# Altium project BLDC-Driver.PrjPcb
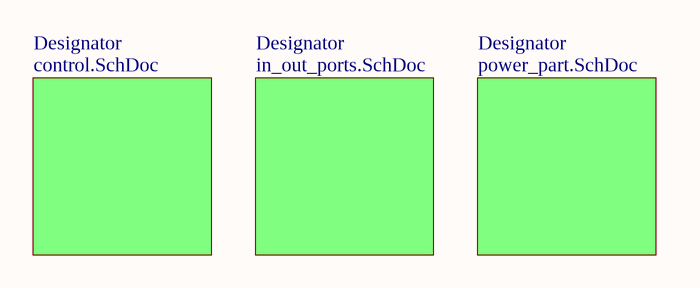
[diagram p0: main.SchDoc]
4 sheets, 59 parts. Net scope: global (net labels, ports and power ports of the same name join across sheets).
Board file: BLDC-Driver.PcbDoc
Sheets:
  main.SchDoc
    Designator = control.SchDoc
    Designator = in_out_ports.SchDoc
    Designator = power_part.SchDoc

## Sheet main.SchDoc
size A; SheetNumber: 1; SheetTotal: 4

### Sub-sheets
Designator = control.SchDoc: no entries
Designator = in_out_ports.SchDoc: no entries
Designator = power_part.SchDoc: no entries

## Sheet control.SchDoc
size A; SheetNumber: 4; SheetTotal: 4
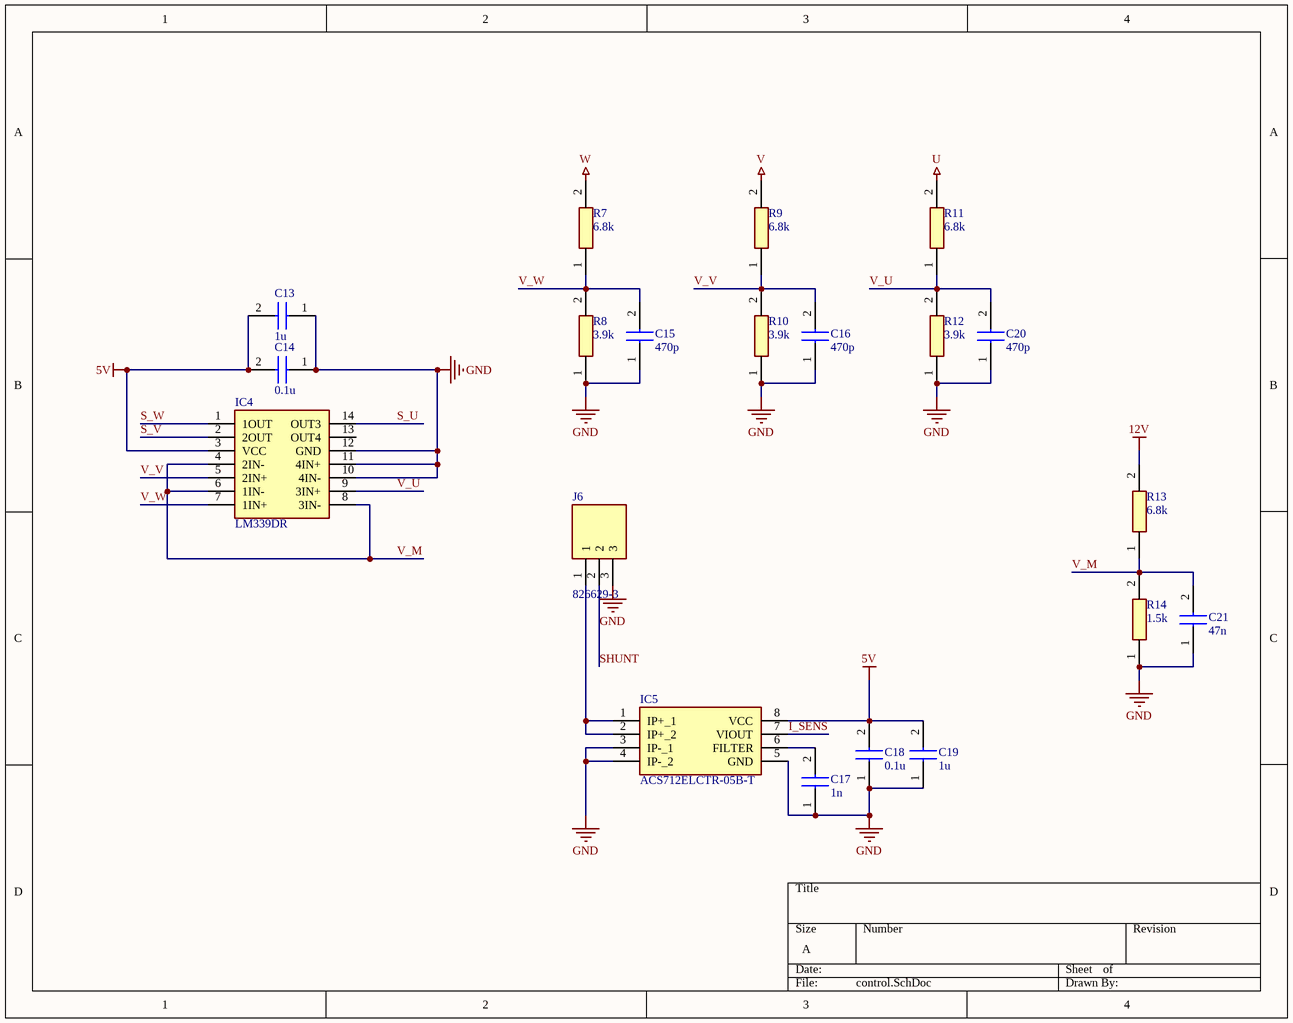
[diagram p1: control.SchDoc]

### Parts
C13  1u  [CAPC2012X145N]
C14  0.1u  [CAPC2012X95N]
C15  470p  [CAPC2012X70N]
C16  470p  [CAPC2012X70N]
C17  1n  [CAPC2012X95N]
C18  0.1u  [CAPC2012X95N]
C19  1u  [CAPC2012X145N]
C20  470p  [CAPC2012X70N]
C21  47n  [CAPC2012X70N]
IC4  LM339DR  [SOIC127P600X175-14N]
IC5  ACS712ELCTR-05B-T  [SOIC127P600X175-8N]
J6  826629-3  [HDRV3W63P0X254_1X3_762X250X950P]
R7  6.8k  [RESC2012X60N]
R8  3.9k  [RESC2012X60N]
R9  6.8k  [RESC2012X60N]
R10  3.9k  [RESC2012X60N]
R11  6.8k  [RESC2012X60N]
R12  3.9k  [RESC2012X60N]
R13  6.8k  [RESC2012X60N]
R14  1.5k  [RESC2012X60N]

### Nets
5V: C13.2 C14.2 C18.2 C19.2 IC4.3(VCC) IC5.8(VCC)
12V: R13.2
GND: C13.1 C14.1 C15.1 C16.1 C17.1 C18.1 C19.1 C20.1 C21.1 IC4.10(4IN-) IC4.11(4IN+) IC4.12(GND) IC5.3(IP-_1) IC5.4(IP-_2) IC5.5(GND) J6.3 R8.1 R10.1 R12.1 R14.1
U: R11.2
V: R9.2
W: R7.2
I_SENS: IC5.7(VIOUT)
S_U: IC4.14(OUT3)
S_V: IC4.2(2OUT)
S_W: IC4.1(1OUT)
SHUNT: J6.2
V_M: C21.2 IC4.4(2IN-) IC4.6(1IN-) IC4.8(3IN-) R13.1 R14.2
V_U: C20.2 IC4.9(3IN+) R11.1 R12.2
V_V: C16.2 IC4.5(2IN+) R9.1 R10.2
V_W: C15.2 IC4.7(1IN+) R7.1 R8.2
NetC17_2: C17.2 IC5.6(FILTER)
NetIC5_1: IC5.1(IP+_1) IC5.2(IP+_2) J6.1

Not connected (* = marked no-connect by the designer): IC4 13(OUT4)

### Library data of the parts
C13 C19 = GRM21BR71C105KA01K: Capacitor; Manufacturer_Name: Murata Electronics; Datasheet Link: http://www.murata.com/~/media/webrenewal/support/library/catalog/products/capacitor/mlcc/c02e.pdf; Height: 1.45mm; Manufacturer_Part_Number: GRM21BR71C105KA01K; Mouser Part Number: 81-GRM40X105K16K; Mouser Price/Stock: https://www.mouser.co.uk/ProductDetail/Murata-Electronics/GRM21BR71C105KA01K?qs=WNiIrCCjU2S8h%252B9o4PZIpA%3D%3D; Arrow Part Number: GRM21BR71C105KA01K; Arrow Price/Stock: https://www.arrow.com/en/products/grm21br71c105ka01k/murata-manufacturing?region=nac
C14 C17 C18 = GRM219F51H104ZA01B: Capacitor; Manufacturer_Name: Murata Electronics; Datasheet Link: http://www.murata.com/~/media/webrenewal/support/library/catalog/products/capacitor/mlcc/c02e.pdf; Height: 0.95mm; Manufacturer_Part_Number: GRM219F51H104ZA01B; Mouser Part Number: 81-GRM21F51H104ZA01B; Mouser Price/Stock: https://www.mouser.co.uk/ProductDetail/Murata-Electronics/GRM219F51H104ZA01B?qs=A13M%252BoT%252Bkzo6MjTOB8REcg%3D%3D
C15 C16 C20 C21 = GRM2165C1H471JA01D: Capacitor; Manufacturer_Name: Murata Electronics; Datasheet Link: http://www.murata.com/~/media/webrenewal/support/library/catalog/products/capacitor/mlcc/c02e.pdf; Height: 0.7mm; Manufacturer_Part_Number: GRM2165C1H471JA01D; Mouser Part Number: 81-GRM215C1H471JA01D; Mouser Price/Stock: https://www.mouser.co.uk/ProductDetail/Murata-Electronics/GRM2165C1H471JA01D?qs=kEQ31%252BHm99mGVasPXslxeg%3D%3D; Arrow Part Number: GRM2165C1H471JA01D; Arrow Price/Stock: https://www.arrow.com/en/products/grm2165c1h471ja01d/murata-manufacturing?region=nac
IC4 = LM339DR: Integrated Circuit; Manufacturer_Name: Texas Instruments; Datasheet Link: http://www.ti.com/lit/gpn/lm339; Height: 1.75mm; Manufacturer_Part_Number: LM339DR; Mouser Part Number: 595-LM339DR; Mouser Price/Stock: https://www.mouser.co.uk/ProductDetail/Texas-Instruments/LM339DR?qs=vxEfx8VrU7Aps9Hd52ppTA%3D%3D; Arrow Part Number: LM339DR; Arrow Price/Stock: https://www.arrow.com/en/products/lm339dr/texas-instruments?region=nac
IC5 = ACS712ELCTR-05B-T: Integrated Circuit; Manufacturer_Name: Allegro Microsystems; Datasheet Link: https://www.allegromicro.com/~/media/Files/Datasheets/ACS712-Datasheet.ashx; Height: 1.75mm; Manufacturer_Part_Number: ACS712ELCTR-05B-T; Mouser Part Number: 250-712ELCTR05BT; Mouser Price/Stock: https://www.mouser.co.uk/ProductDetail/Allegro-MicroSystems/ACS712ELCTR-05B-T?qs=pUKx8fyJudDs65Rkshv5ug%3D%3D; Arrow Part Number: ACS712ELCTR-05B-T; Arrow Price/Stock: https://www.arrow.com/en/products/acs712elctr-05b-t/allegro-microsystems?region=europe
J6 = 826629-3: Connector; Manufacturer_Name: TE Connectivity; Datasheet Link: http://www.te.com/commerce/DocumentDelivery/DDEController?Action=showdoc&DocId=Customer+Drawing%7F826629%7FAA%7Fpdf%7FEnglish%7FENG_CD_826629_AA_baseFilename.pdf%7F826629-3.pdf; Height: 9.5mm; Manufacturer_Part_Number: 826629-3; Mouser Part Number: 571-826629-3; Mouser Price/Stock: https://www.mouser.co.uk/ProductDetail/TE-Connectivity/826629-3?qs=AplfTeSvkkA3hKOe%252BWTzDA%3D%3D; Arrow Part Number: 826629-3; Arrow Price/Stock: https://www.arrow.com/en/products/826629-3/te-connectivity?region=europe
R7 R9 R11 R13 = RC0805FR-076K8L: Resistor; Manufacturer_Name: KEMET; Datasheet Link: http://www.yageo.com/documents/recent/PYu-RC_Group_51_RoHS_L_10.pdf; Height: 0.6mm; Manufacturer_Part_Number: RC0805FR-076K8L; Mouser Part Number: 603-RC0805FR-076K8L; Mouser Price/Stock: https://www.mouser.com/Search/Refine.aspx?Keyword=603-RC0805FR-076K8L; Arrow Part Number: RC0805FR-076K8L; Arrow Price/Stock: https://www.arrow.com/en/products/rc0805fr-076k8l/yageo
R8 R10 R12 = RC0805FR-073K9L: Resistor; Manufacturer_Name: KEMET; Datasheet Link: http://www.yageo.com/documents/recent/PYu-RC_Group_51_RoHS_L_10.pdf; Height: 0.6mm; Manufacturer_Part_Number: RC0805FR-073K9L; Mouser Part Number: 603-RC0805FR-073K9L; Mouser Price/Stock: https://www.mouser.com/Search/Refine.aspx?Keyword=603-RC0805FR-073K9L
R14 = RC0805FR-071K5L: Resistor; Manufacturer_Name: YAGEO; Datasheet Link: https://br.mouser.com/datasheet/2/447/YAGEO_PYu_RC_Group_51_RoHS_L_12-3313492.pdf; Height: 0.6mm; Manufacturer_Part_Number: RC0805FR-071K5L; Mouser Part Number: 603-RC0805FR-071K5L; Mouser Price/Stock: https://www.mouser.co.uk/ProductDetail/YAGEO/RC0805FR-071K5L?qs=8Y8p%252BasKcI6LbaohOVk4HA%3D%3D; Arrow Part Number: RC0805FR-071K5L; Arrow Price/Stock: https://www.arrow.com/en/products/rc0805fr-071k5l/yageo?region=nac

## Sheet in_out_ports.SchDoc
size A; SheetNumber: 2; SheetTotal: 4
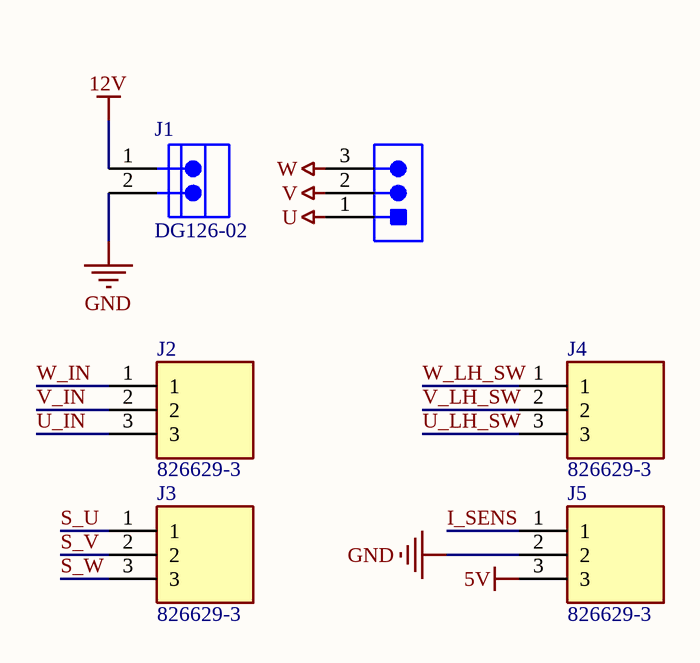
[diagram p2: in_out_ports.SchDoc]

### Parts
J1  DG126-02  [CXKF-KF129C-2_V]
J2  826629-3  [HDRV3W63P0X254_1X3_762X250X950P]
J3  826629-3  [HDRV3W63P0X254_1X3_762X250X950P]
J4  826629-3  [HDRV3W63P0X254_1X3_762X250X950P]
J5  826629-3  [HDRV3W63P0X254_1X3_762X250X950P]
MOTOR  SCREW-5.0/5.08 3WAYS  [SCREW-5.0-3WAYS_V]  (value not drawn)

### Nets
5V: J5.3
12V: J1.1
GND: J1.2 J5.2
U: MOTOR.1
V: MOTOR.2
W: MOTOR.3
I_SENS: J5.1
S_U: J3.1
S_V: J3.2
S_W: J3.3
U_IN: J2.3
U_LH_SW: J4.3
V_IN: J2.2
V_LH_SW: J4.2
W_IN: J2.1
W_LH_SW: J4.1

### Library data of the parts
J1 = CMP-0813-00004-1: Euro Terminal Block, 20 A, 300 V, -40 to 105 degC, Pitch 5 mm, 1 x 2 Position, Height 19.2 mm, Tail Length 3.5 mm; PartNumber: KF129C-02P-14; Manufacturer: Cixi KaiFeng; Insulation Resistance: 5000 MOhm / 1000 V; Pitch: Single Pitch; No. of Pole: 2; Rated Voltage: 300 V; Contact: Brass; Rated Current: 20 A; Contact Resistance: 20 mOhm; Withstanding Voltage: AC 1500 V / 1 Min; ComponentLink2Description: Datasheet; PackageReference: KF129C-2; ComponentLink1URL: http://www.nb-kaifeng.com/; ComponentLink2URL: http://www.nb-kaifeng.com/upload/editor/ext_pdf/201208170644598657.pdf; Color: Green; PackageDescription: Terminal Block, Pitch 5 mm, 1 x 2 Position, Height 19.2 mm, Tail Length 3.5 mm; Temp. Range: -40 to 105 degC; Mounting Technology: Through Hole; ComponentLink1Description: Manufacturer URL
J2-J5 = 826629-3: as J6 on sheet control; Datasheet Link: http://www.te.com/commerce/DocumentDelivery/DDEController?Action=showdoc&DocId=Customer+Drawing%7F826629%7FAA%7Fpdf%7FEnglish%7FENG_CD_826629_AA_baseFilename.pdf%7F826629-3.pdf; Height: 9.5mm; Manufacturer_Part_Number: 826629-3; Mouser Part Number: 571-826629-3; Mouser Price/Stock: https://www.mouser.co.uk/ProductDetail/TE-Connectivity/826629-3?qs=AplfTeSvkkA3hKOe%252BWTzDA%3D%3D; Arrow Part Number: 826629-3; Arrow Price/Stock: https://www.arrow.com/en/products/826629-3/te-connectivity?region=europe
MOTOR = CMP-0617-00010-1: Socket, Screw Terminal Block, 3 Way, 5.0 mm Pitch, 90 Degree Angle, Through-Hole; Manufacturer: No Vendor; Insulation Resistance: 5000 MOhm / 1000 V; Rated Voltage: 300 V; Poles: 3; Contact Resistance: 20 mOhm; Rated Current: 25 A; PartNumber: SCREW-5.0/5.08 3WAYS; PackageDescription: Socket, Screw Terminal Block, 3 Way, Pitch 5 mm, 90 Degree Angle, Through-Hole; Temperature Range: -40 to 105 degC; ComponentLink1Description: Datasheet; ComponentLink1URL: 5mm screw terminal in SVN; Mounting Technology: Through Hole

## Sheet power_part.SchDoc
size A; SheetNumber: 3; SheetTotal: 4
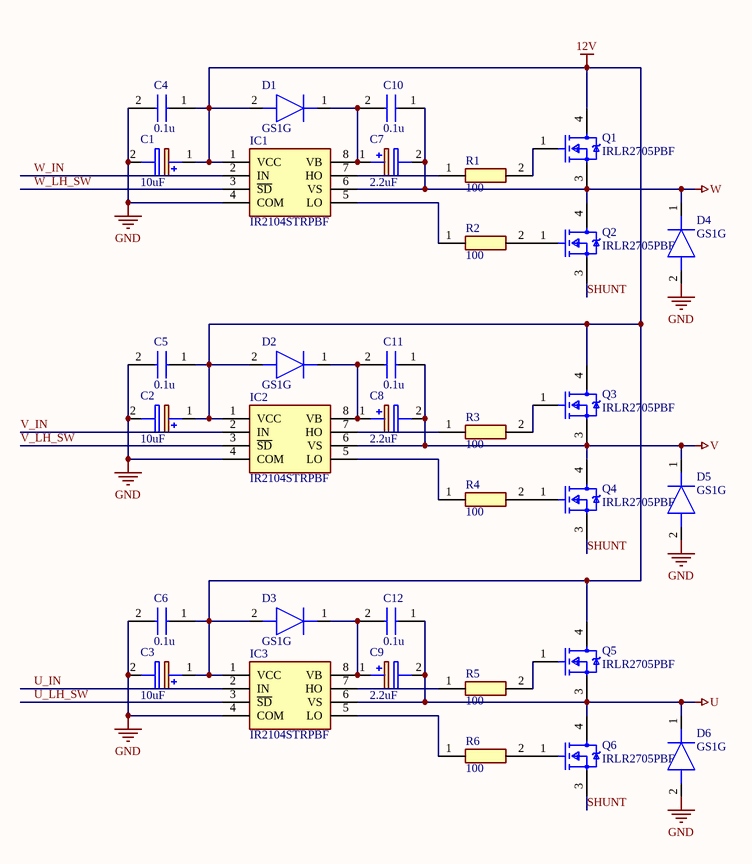
[diagram p3: power_part.SchDoc]

### Parts
C1  10uF  [EEE1AA220WR]
C2  10uF  [EEE1AA220WR]
C3  10uF  [EEE1AA220WR]
C4  0.1u  [CAPC2012X95N]
C5  0.1u  [CAPC2012X95N]
C6  0.1u  [CAPC2012X95N]
C7  2.2uF  [EEE1AA220WR]
C8  2.2uF  [EEE1AA220WR]
C9  2.2uF  [EEE1AA220WR]
C10  0.1u  [CAPC2012X95N]
C11  0.1u  [CAPC2012X95N]
C12  0.1u  [CAPC2012X95N]
D1  GS1G  [DIOM5027X244N]
D2  GS1G  [DIOM5027X244N]
D3  GS1G  [DIOM5027X244N]
D4  GS1G  [DIOM5027X244N]
D5  GS1G  [DIOM5027X244N]
D6  GS1G  [DIOM5027X244N]
IC1  IR2104STRPBF  [SOIC127P600X175-8N]
IC2  IR2104STRPBF  [SOIC127P600X175-8N]
IC3  IR2104STRPBF  [SOIC127P600X175-8N]
Q1  IRLR2705PBF  [FP-PG-TO252-3-MFG]
Q2  IRLR2705PBF  [FP-PG-TO252-3-MFG]
Q3  IRLR2705PBF  [FP-PG-TO252-3-MFG]
Q4  IRLR2705PBF  [FP-PG-TO252-3-MFG]
Q5  IRLR2705PBF  [FP-PG-TO252-3-MFG]
Q6  IRLR2705PBF  [FP-PG-TO252-3-MFG]
R1  100  [RESC2012X60N]
R2  100  [RESC2012X60N]
R3  100  [RESC2012X60N]
R4  100  [RESC2012X60N]
R5  100  [RESC2012X60N]
R6  100  [RESC2012X60N]

### Nets
12V: C1.1(+) C2.1(+) C3.1(+) C4.1 C5.1 C6.1 D1.2(A) D2.2(A) D3.2(A) IC1.1(VCC) IC2.1(VCC) IC3.1(VCC) Q1.4(D) Q3.4(D) Q5.4(D)
GND: C1.2(-) C2.2(-) C3.2(-) C4.2 C5.2 C6.2 D4.2(A) D5.2(A) D6.2(A) IC1.4(COM) IC2.4(COM) IC3.4(COM)
U: C9.2(-) C12.1 D6.1(K) IC3.6(VS) Q5.3(S) Q6.4(D)
V: C8.2(-) C11.1 D5.1(K) IC2.6(VS) Q3.3(S) Q4.4(D)
W: C7.2(-) C10.1 D4.1(K) IC1.6(VS) Q1.3(S) Q2.4(D)
SHUNT: Q2.3(S) Q4.3(S) Q6.3(S)
U_IN: IC3.2(IN)
U_LH_SW: IC3.3(~{SD})
V_IN: IC2.2(IN)
V_LH_SW: IC2.3(~{SD})
W_IN: IC1.2(IN)
W_LH_SW: IC1.3(~{SD})
NetC7_1: C7.1(+) C10.2 D1.1(K) IC1.8(VB)
NetC8_1: C8.1(+) C11.2 D2.1(K) IC2.8(VB)
NetC9_1: C9.1(+) C12.2 D3.1(K) IC3.8(VB)
NetIC1_5: IC1.5(LO) R2.1
NetIC1_7: IC1.7(HO) R1.1
NetIC2_5: IC2.5(LO) R4.1
NetIC2_7: IC2.7(HO) R3.1
NetIC3_5: IC3.5(LO) R6.1
NetIC3_7: IC3.7(HO) R5.1
NetQ1_1: Q1.1(G) R1.2
NetQ2_1: Q2.1(G) R2.2
NetQ3_1: Q3.1(G) R3.2
NetQ4_1: Q4.1(G) R4.2
NetQ5_1: Q5.1(G) R5.2
NetQ6_1: Q6.1(G) R6.2

### Library data of the parts
C1-C3 = EEE-FK1E100R: Capacitor Polarised; Manufacturer_Name: Panasonic; Datasheet Link: http://industrial.panasonic.com/cdbs/www-data/pdf/RDE0000/ABA0000C1181.pdf; Height: 5.5mm; Manufacturer_Part_Number: EEE-FK1E100R; Mouser Part Number: 667-EEE-FK1E100R; Mouser Price/Stock: https://www.mouser.co.uk/ProductDetail/Panasonic/EEE-FK1E100R?qs=qE6bgDGEOCuIB5AxqKF88Q%3D%3D; Arrow Part Number: EEE-FK1E100R; Arrow Price/Stock: https://www.arrow.com/en/products/eeefk1e100r/panasonic?region=nac
C4-C6 C10-C12 = GRM219F51H104ZA01B: as C14 on sheet control; Datasheet Link: http://www.murata.com/~/media/webrenewal/support/library/catalog/products/capacitor/mlcc/c02e.pdf; Height: 0.95mm; Manufacturer_Part_Number: GRM219F51H104ZA01B; Mouser Part Number: 81-GRM21F51H104ZA01B; Mouser Price/Stock: https://www.mouser.co.uk/ProductDetail/Murata-Electronics/GRM219F51H104ZA01B?qs=A13M%252BoT%252Bkzo6MjTOB8REcg%3D%3D
C7-C9 = EEE-HB1H2R2AR: Capacitor Polarised; Manufacturer_Name: Panasonic; Datasheet Link: http://industrial.panasonic.com/cdbs/www-data/pdf/RDE0000/ABA0000C1154.pdf; Height: 5.5mm; Manufacturer_Part_Number: EEE-HB1H2R2AR; Mouser Part Number: 667-EEE-HB1H2R2AR; Mouser Price/Stock: https://www.mouser.co.uk/ProductDetail/Panasonic/EEE-HB1H2R2AR?qs=d1CqaRUMZD8bJW987Ww1zg%3D%3D; Arrow Part Number: EEE-HB1H2R2AR; Arrow Price/Stock: https://www.arrow.com/en/products/eee-hb1h2r2ar/panasonic
D1-D6 = GS1G: Diode; Manufacturer_Name: PANJIT International Inc; Datasheet Link: https://www.panjit.com.tw/en/Product/downloadPDF/GS1G; Height: 2.44mm; Manufacturer_Part_Number: GS1G
IC1-IC3 = IR2104STRPBF: Integrated Circuit; Manufacturer_Name: Infineon; Datasheet Link: https://www.infineon.com/cms/en/product/power/gate-driver-ics/?; Height: 1.75mm; Manufacturer_Part_Number: IR2104STRPBF; Mouser Part Number: 942-IR2104STRPBF; Mouser Price/Stock: https://www.mouser.co.uk/ProductDetail/Infineon-Technologies/IR2104STRPBF?qs=2r01AXMCG3NCbspWVHqTYw%3D%3D; Arrow Part Number: IR2104STRPBF; Arrow Price/Stock: https://www.arrow.com/en/products/ir2104strpbf/infineon-technologies-ag?region=nac
Q1-Q6 = CMP-32901-000108-1: MOSFET N-CH 55V 44A DPAK; Manufacturer: Infineon; Manufacturer Part Number: IRFR1205TRPBF; Input Capacitace At Vds: 1300pF @ 25V; Depletion Mode: False; Pulse Drain Current: 160A; Gate Charge At Vgs: 65nC @ 10V; Gate To Source Voltage: 20V; Turn On Delay Time: 7.3ns; Number Of Channels: 1; Transconductance: 17S; Reverse Recovery Time: 65ns; Threshold Vgs Max: 4V; Turn Off Delay Time: 47ns; Threshold Vgs Min: 2V; Reverse Recovery Charge: 160nC; Rthja Max: 50°C/W; Drain To Source Resistance: 0.027Ω; Max Junction Temp: +175°C; Max Forward Diode Voltage: 1.3V; Power Dissipation: 107W; RoHS: TRUE; Category: Trans; Height: 2.52mm; Drain To Source Voltage: 55V; Device Class L1: Discrete Semiconductors; Octopart: https://octopart.com/irfr1205trpbf-infineon-65874068; Drain To Source Breakdown Voltage: 55V; Number Of N Channels: 1; ComponentLink2URL: https://www.infineon.com/dgdl/irfr1205pbf.pdf?fileId=5546d462533600a40153562d17792047; Temperature Range Low: -55°C; Temperature: -55°C to +175°C; Digikey Description: MOSFET N-CH 55V 44A DPAK; Device Class L2: Transistors; Temperature Range High: +175°C; Package: PG-TO252-3; Automotive: No; Continuous Drain Current: 44A; Device Class L3: MOSFETs; ComponentLink2Description: Datasheet; Footprint Url: https://www.infineon.com/cms/en/product/packages/PG-TO252/PG-TO252-3-901/; Lead Free: Yes
R1-R6 = RC0805JR-0720RL: Resistor; Manufacturer_Name: KEMET; Datasheet Link: http://www.yageo.com/documents/recent/PYu-RC_Group_51_RoHS_L_10.pdf; Height: 0.6mm; Manufacturer_Part_Number: RC0805JR-0720RL; Mouser Part Number: 603-RC0805JR-0720RL; Mouser Price/Stock: https://www.mouser.com/Search/Refine.aspx?Keyword=603-RC0805JR-0720RL; Arrow Part Number: RC0805JR-0720RL; Arrow Price/Stock: https://www.arrow.com/en/products/rc0805jr-0720rl/yageo

## Nets that join several sheets
5V: control (6 pins), in_out_ports (J5.3)
12V: control (R13.2), in_out_ports (J1.1), power_part (15 pins)
GND: control (20 pins), in_out_ports (J1.2 J5.2), power_part (12 pins)
U: control (R11.2), in_out_ports (MOTOR.1), power_part (6 pins)
V: control (R9.2), in_out_ports (MOTOR.2), power_part (6 pins)
W: control (R7.2), in_out_ports (MOTOR.3), power_part (6 pins)
I_SENS: control (IC5.7), in_out_ports (J5.1)
S_U: control (IC4.14), in_out_ports (J3.1)
S_V: control (IC4.2), in_out_ports (J3.2)
S_W: control (IC4.1), in_out_ports (J3.3)
SHUNT: control (J6.2), power_part (Q2.3 Q4.3 Q6.3)
U_IN: in_out_ports (J2.3), power_part (IC3.2)
U_LH_SW: in_out_ports (J4.3), power_part (IC3.3)
V_IN: in_out_ports (J2.2), power_part (IC2.2)
V_LH_SW: in_out_ports (J4.2), power_part (IC2.3)
W_IN: in_out_ports (J2.1), power_part (IC1.2)
W_LH_SW: in_out_ports (J4.1), power_part (IC1.3)